# Altium schematic sheet Triangle_Generator.SchDoc
size A; SheetNumber: 2; SheetTotal: 2
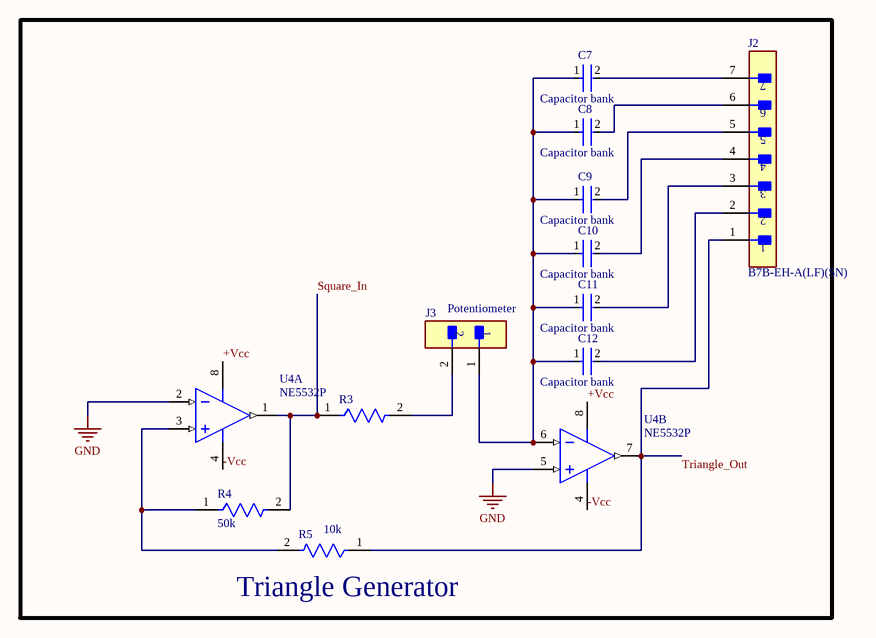
[diagram p0: Triangle_Generator.SchDoc]

## Parts
C7  Capacitor bank  [FP-F471K33Y5RP6UK5R-MFG]
C8  Capacitor bank  [FP-F471K33Y5RP6UK5R-MFG]
C9  Capacitor bank  [FP-F471K33Y5RP6UK5R-MFG]
C10  Capacitor bank  [FP-F471K33Y5RP6UK5R-MFG]
C11  Capacitor bank  [FP-F471K33Y5RP6UK5R-MFG]
C12  Capacitor bank  [FP-F471K33Y5RP6UK5R-MFG]
J2  B7B-EH-A(LF)(SN)  [FP-B7B-EH-A_LF_SN-MFG]
J3  Potentiometer  [FP-B2B-XH-A_LF_SN-MFG]
R3  (no value)  [FP-VR37-MFG]
R4  50k  [FP-VR37-MFG]
R5  10k  [FP-VR37-MFG]
U4  NE5532P  [P0008A]  (parts A,B of 2)

## Blocks framed on the sheet
Triangle Generator: C7-C12 J2 J3 R3-R5 U4

## Nets
GND: U4.2(IN1-) U4.5(IN2+)
+Vcc: U4.8(VCC+)
-Vcc: U4.4(VCC-)
Square_In: R3.1 R4.2 U4.1(OUT1)
Triangle_Out: J2.1 R5.1 U4.7(OUT2)
NetC7_1: C7.1 C8.1 C9.1 C10.1 C11.1 C12.1 J3.1 U4.6(IN2-)
NetC7_2: C7.2 J2.7
NetC8_2: C8.2 J2.6
NetC9_2: C9.2 J2.5
NetC10_2: C10.2 J2.4
NetC11_2: C11.2 J2.3
NetC12_2: C12.2 J2.2
NetJ3_2: J3.2 R3.2
NetR4_1: R4.1 R5.2 U4.3(IN1+)

## Library data of the parts
C7-C12 = CMP-02417-000080-1: CAP CER 470PF 2KV Y5R RADIAL; Tolerance: 10%; Dielectric Material: Ceramic; Insulation Resistance: 10GR; Lead/Base Style: Kinked; Lead Diameter: 0.8mm; Series: F; Depth: 5mm; Package Quantity: 1500; Resistor Type: Ceramic; Construction: RADIAL; Min Operating Temperature: -30°C; Mount: Through Hole; Radiation Hardening: No; Voltage: 2kV; Voltage Rating: 2kV; Max Operating Temperature: 125°C; Termination: Radial; RoHS Compliant: Yes; Lead Pitch: 5mm; Capacitance: 470pF; Packaging: Tape and Reel; Length: 8.5mm; Case/Package: Radial; Dielectric: Y5R
J2 = CMP-17439-000532-1: CONN HEADER VERT 7POS 2.5MM; Number of Contacts: 7; Mated Stacking Heights: 8.1mm; Gender: Male; Current Rating: 3A; Voltage Rating: 250V; Termination: Solder; Contact Material: Brass; Connector Type: Header; Flammability Rating: UL94 V-0; Housing Material: Nylon; Series: EH; Fastening Type: Friction; Lead Free: Lead Free; Insulation Color: Natural; Contact Type: Male Pin; Number of Rows: 1; Packaging: Bulk; Color: Natural; Contact Finish - Mating: TIN; Orientation: Straight; Contact Shape: Square; Contact Plating: Tin; Insulation Material: Nylon; Housing Color: White; Mount: Through Hole; Contact Mating Length: 0.13inch; Pitch: 2.5mm; Number of Positions: 7
J3 = CMP-2000-05888-3: CONN HEADER VERT 2POS 2.5MM; Current Rating: 3A; Voltage Rating: 250V; Number of Contacts: 2; Contact Resistance: 20mR; Wire/Cable Gauge: 22AWG; Insulation Resistance: 1GR; Connector Type: Male Pin; Packaging: Bulk; Contact Material: Brass; Lead Free: Lead Free; Orientation: Straight; Contact Plating: Tin; Max Current Rating: 3A; Termination: Solder; Fastening Type: Detent; Depth: 5.75mm; Housing Material: Polyamide; REACH SVHC: No SVHC; Series: XH; Voltage Rating (AC): 250V; Number of Positions: 2; Color: Natural; Contact Type: Male Pin; Max Voltage Rating (DC): 250V; Pitch: 2.5mm; Lead Pitch: 2.5mm; Mount: Through Hole; Max Operating Temperature: 85°C; Length: 7.4mm; Max Voltage Rating (AC): 250V; Min Operating Temperature: -25°C; Number of Rows: 1; Housing Color: White
R3-R5 = CMP-02408-000054-1: RES 1.2M OHM 5% 1/2W AXIAL; Voltage Rating: 3.5kV; Power Rating: 500mW; Temperature Coefficient: 200ppm/°C; Resistance: 1.2MR; Diameter: 4mm; Max Operating Temperature: 155°C; Military Standard: Not; Reach SVHC Compliant: Yes; Min Operating Temperature: -55°C; Resistance Tolerance: 5%; Resistor Type: Metal Film; Tolerance: 5%; Mount: Through Hole; Construction: Cylindrical; Contact Plating: Tin; Length: 10mm; Termination: Axial; Voltage Rating (DC): 3.5kV; Packaging: Ammo Pack; Radiation Hardening: No; Case/Package: Conformal
U4 = CMP-0017-00910-2: Dual Low-Noise High-Speed Audio Operational Amplifier, 10 to 30 V, 0 to 70 degC, 8-pin DIP (P8), Pb-Free (RoHS); Manufacturer: Texas Instruments; Iq per channel(Max)(mA): 4; Slew Rate(Typ)(V/us): 9; Vn at 1kHz(Typ)(nV/rtHz): 5; IIB(Max)(pA): 800000; Total Supply Voltage(Max)(+5V is 5, +/-5V is 10): 30; GBW(Typ)(MHz): 10; CMRR(Min)(dB): 70; Number of Channels: 2; Sub Family: General Purpose Amplifier, High Supply Voltage Amplifier (>=30V), Low Noise Amp (<=10nV/rtHz); ComponentLink2URL: http://www.ti.com/lit/ds/symlink/ne5532.pdf; PackageReference: P0008A; PackageDescription: 8-Pin Plastic In-Line, Body 9.59 x 6.35 mm, Pitch 2.54 mm; ComponentLink1Description: Manufacturer URL; Eco-Plan: Pb-Free (RoHS); Mounting Technology: Through Hole; Code_JEDEC: MS-001; PackageVersion: 4040082/E, 04/2010; DatasheetVersion: SLOS075I; ComponentLink3URL: http://www.ti.com/litv/pdf/mpdi001b; ComponentLink2Description: Datasheet; Vio (25C)(Max)(mV): 4; PartNumber: NE5532P; ComponentLink3Description: Package Specification; Total Supply Voltage(Min)(+5V is 5, +/-5V is 10): 10; ComponentLink1URL: http://www.ti.com/